# EAGLE schematic Controller v1.1 (EAGLE 9.6.2)
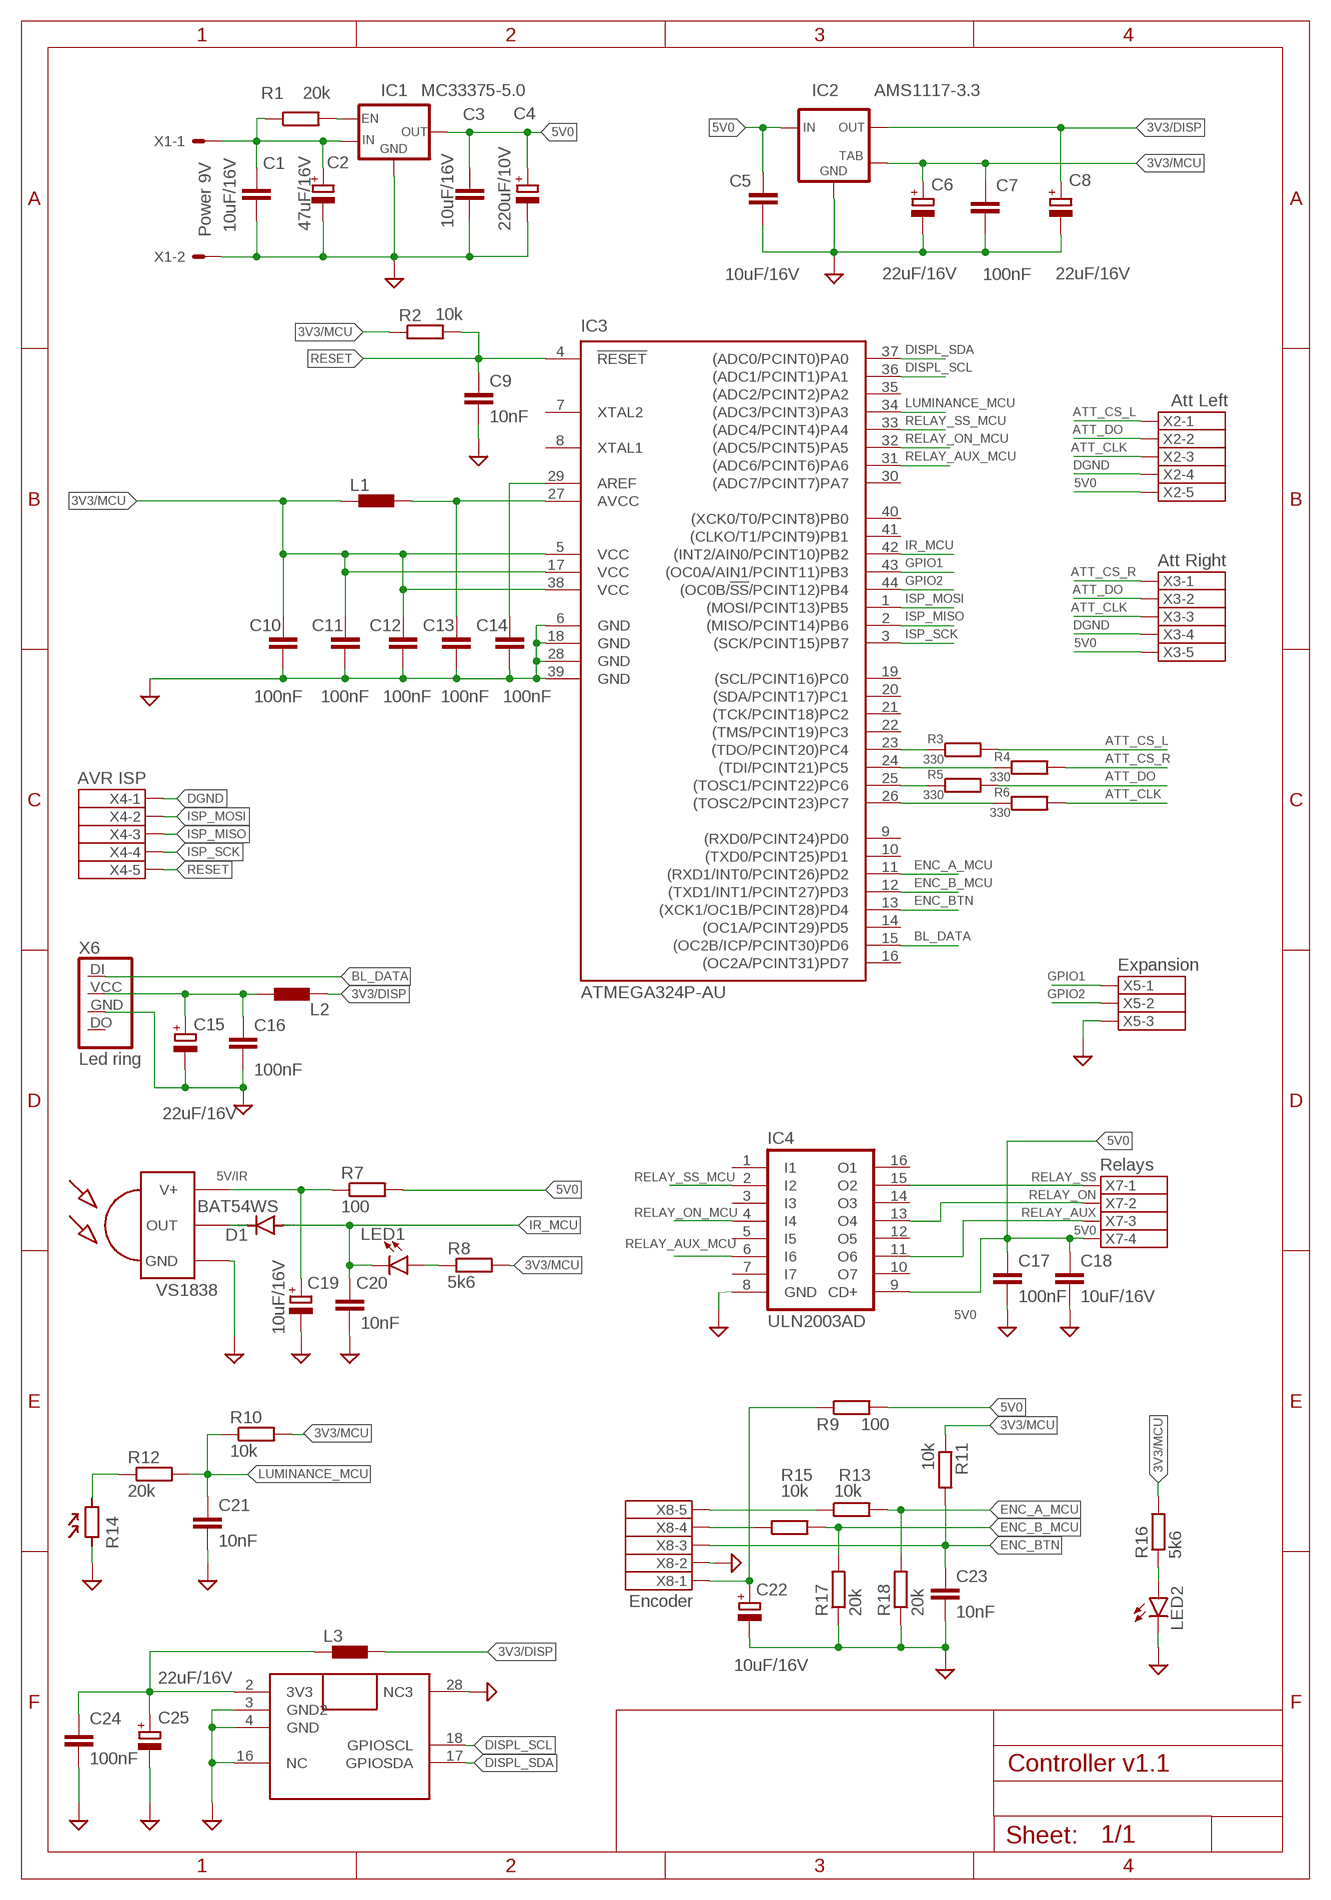
[diagram p0: schematic, sheet 1]

## Parts
C1  10uF/16V  C-EUC0805  [C0805]
C2  47uF/16V  CPOL-EUSMCC  [SMC_C]
C3  10uF/16V  C-EUC0805  [C0805]
C4  220uF/10V  CPOL-EUSMCC  [SMC_C]
C5  10uF/16V  C-EUC0805  [C0805]
C6  22uF/16V  CPOL-EUSMCB  [SMC_B]
C7  100nF  C-EUC0603  [C0603]
C8  22uF/16V  CPOL-EUSMCB  [SMC_B]
C9  10nF  C-EUC0603  [C0603]
C10  100nF  C-EUC0603  [C0603]
C11  100nF  C-EUC0603  [C0603]
C12  100nF  C-EUC0603  [C0603]
C13  100nF  C-EUC0603  [C0603]
C14  100nF  C-EUC0603  [C0603]
C15  22uF/16V  CPOL-EUSMCB  [SMC_B]
C16  100nF  C-EUC0603  [C0603]
C17  100nF  C-EUC0603  [C0603]
C18  10uF/16V  C-EUC0805  [C0805]
C19  10uF/16V  CPOL-EUSMCA  [SMC_A]
C20  10nF  C-EUC0603  [C0603]
C21  10nF  C-EUC0603  [C0603]
C22  10uF/16V  CPOL-EUSMCA  [SMC_A]
C23  10nF  C-EUC0603  [C0603]
C24  100nF  C-EUC0603  [C0603]
C25  22uF/16V  CPOL-EUSMCB  [SMC_B]
D1  BAT54WS  DIODE-SOD323-W  [SOD323-W]
DM1  FEATHERWING_ZD50DISPLAY_ZD50  [FEATHERWING_ZD50]
IC1  MC33375-5.0  MC33375  [SOT223]
IC2  AMS1117-3.3  LM1117  [SOT223]
IC3  ATMEGA324P-AU  MEGA164P/324P/644P-AU  [TQFP44]
IC4  ULN2003AD  [SO16]
IR1  VS1838  TSOP1838  [TSOP18XX]
L1  BLM21PG221SN1D  BLM21PG2210805  [0805]
L2  BLM21PG221SN1D  BLM21PG2210805  [0805]
L3  10uH  BLM21PG2210805  [0805]
LED1  LEDSML0805  [SML0805]
LED2  LEDSML0805  [SML0805]
R1  20k  R-EU_R0603  [R0603]
R2  10k  R-EU_R0805  [R0805]
R3  330  R-EU_R0805  [R0805]
R4  330  R-EU_R0805  [R0805]
R5  330  R-EU_R0805  [R0805]
R6  330  R-EU_R0805  [R0805]
R7  100  R-EU_R0805  [R0805]
R8  5k6  R-EU_R0805  [R0805]
R9  100  R-EU_R1206  [R1206]
R10  10k  R-EU_R0805  [R0805]
R11  10k  R-EU_R1206  [R1206]
R12  20k  R-EU_R0805  [R0805]
R13  10k  R-EU_R0805  [R0805]
R14  GL5537  [GL55]
R15  10k  R-EU_R0805  [R0805]
R16  5k6  R-EU_R0805  [R0805]
R17  20k  R-EU_R0805  [R0805]
R18  20k  R-EU_R0805  [R0805]
X1  Power 9V  22-23-2021  [22-23-2021]
X2  Att Left  JST-XH-05-PIN-LONG-PAD  [JST-XH-05-PACKAGE-LONG-PAD]
X3  Att Right  JST-XH-05-PIN-LONG-PAD  [JST-XH-05-PACKAGE-LONG-PAD]
X4  AVR ISP  JST-XH-05-PIN-LONG-PAD  [JST-XH-05-PACKAGE-LONG-PAD]
X5  Expansion  JST-XH-03-PIN-LONG-PAD  [JST-XH-03-PACKAGE-LONG-PAD]
X6  Led ring  LED_RING_CONN  [LED_RING_CONN]
X7  Relays  JST-XH-04-PIN-LONG-PAD  [JST-XH-04-PACKAGE-LONG-PAD]
X8  Encoder  JST-XH-05-PIN-ROUND-PAD  [JST-XH-05-PACKAGE-ROUND-PAD]

## Nets
3V3/AVCC: C13.1 IC3.27(AVCC) L1.2
3V3/DISP: C8.+ IC2.2(OUT) L2.2 L3.2
3V3/MCU: C6.+ C7.1 C10.1 C11.1 C12.1 IC2.4(TAB) IC3.5(VCC) IC3.17(VCC) IC3.38(VCC) L1.1 R2.1 R8.2 R10.2 R11.1 R16.2
5V0: C3.1 C4.+ C5.1 C17.1 C18.1 IC1.3(OUT) IC2.3(IN) IC4.9(CD+) R7.2 R9.2 X2.5 X3.5 X7.4
5V/EN: IC1.2(EN) R1.2
5V/ENC: C22.+ R9.1 X8.1
5V/IR: C19.+ IR1.VCC(V+) R7.1
+9V/IN: C1.1 C2.+ IC1.1(IN) R1.1 X1.1
AREF: C14.1 IC3.29(AREF)
ATT_CLK: R6.2 X2.3 X3.3
ATT_CS_L: R3.2 X2.1
ATT_CS_R: R4.2 X3.1
ATT_DO: R5.2 X2.2 X3.2
BL_3V3: C15.+ C16.1 L2.1 X6.VCC
BL_DATA: IC3.15((OC2B/ICP/PCINT30)PD6) X6.DI
DGND: C1.2 C2.- C3.2 C4.- C5.2 C6.- C7.2 C8.- C9.2 C10.2 C11.2 C12.2 C13.2 C14.2 C15.- C16.2 C17.2 C18.2 C19.- C20.2 C21.2 C22.- C23.2 C24.2 C25.- DM1.3(GND2) DM1.4(GND) DM1.16(NC) DM1.28(NC3) IC1.4(GND) IC2.1(GND) IC3.6(GND) IC3.18(GND) IC3.28(GND) IC3.39(GND) IC4.8(GND) IR1.GND LED2.C R14.P$1 R17.1 R18.1 X1.2 X2.4 X3.4 X4.1 X5.3 X6.GND X8.2
DISPL_3V3: C24.1 C25.+ DM1.2(3V3) L3.1
DISPL_SCL: DM1.18(GPIOSCL) IC3.36((ADC1/PCINT1)PA1)
DISPL_SDA: DM1.17(GPIOSDA) IC3.37((ADC0/PCINT0)PA0)
ENC_A: R13.1 X8.5
ENC_A_MCU: IC3.11((RXD1/INT0/PCINT26)PD2) R13.2 R18.2
ENC_B: R15.1 X8.4
ENC_B_MCU: IC3.12((TXD1/INT1/PCINT27)PD3) R15.2 R17.2
ENC_BTN: C23.1 IC3.13((XCK1/OC1B/PCINT28)PD4) R11.2 X8.3
GPIO1: IC3.43((OC0A/AIN1/PCINT11)PB3) X5.1
GPIO2: IC3.44((OC0B/!SS!/PCINT12)PB4) X5.2
IR_MCU: C20.1 D1.A IC3.42((INT2/AIN0/PCINT10)PB2) LED1.C
IR_OUT: D1.C IR1.OUT
ISP_MISO: IC3.2((MISO/PCINT14)PB6) X4.3
ISP_MOSI: IC3.1((MOSI/PCINT13)PB5) X4.2
ISP_SCK: IC3.3((SCK/PCINT15)PB7) X4.4
LIGHT_SENSOR: R12.1 R14.P$2
LUMINANCE_MCU: C21.1 IC3.34((ADC3/PCINT3)PA3) R10.1 R12.2
N$1: LED2.A R16.1
N$5: LED1.A R8.1
N$7: IC3.23((TDO/PCINT20)PC4) R3.1
N$8: IC3.24((TDI/PCINT21)PC5) R4.1
N$9: IC3.25((TOSC1/PCINT22)PC6) R5.1
N$10: IC3.26((TOSC2/PCINT23)PC7) R6.1
RELAY_AUX: IC4.11(O6) X7.3
RELAY_AUX_MCU: IC3.31((ADC6/PCINT6)PA6) IC4.6(I6)
RELAY_ON: IC4.13(O4) X7.2
RELAY_ON_MCU: IC3.32((ADC5/PCINT5)PA5) IC4.4(I4)
RELAY_SS: IC4.15(O2) X7.1
RELAY_SS_MCU: IC3.33((ADC4/PCINT4)PA4) IC4.2(I2)
RESET: C9.1 IC3.4(!RESET) R2.2 X4.5
Unconnected: IC3.7(XTAL2) IC3.8(XTAL1) IC3.9((RXD0/PCINT24)PD0) IC3.10((TXD0/PCINT25)PD1) IC3.14((OC1A/PCINT29)PD5) IC3.16((OC2A/PCINT31)PD7) IC3.19((SCL/PCINT16)PC0) IC3.20((SDA/PCINT17)PC1) IC3.21((TCK/PCINT18)PC2) IC3.22((TMS/PCINT19)PC3) IC3.30((ADC7/PCINT7)PA7) IC3.35((ADC2/PCINT2)PA2) IC3.40((XCK0/T0/PCINT8)PB0) IC3.41((CLKO/T1/PCINT9)PB1) IC4.1(I1) IC4.3(I3) IC4.5(I5) IC4.7(I7) IC4.10(O7) IC4.12(O5) IC4.14(O3) IC4.16(O1) X6.DO

## Library data of the parts
C1 = rcl:C-EU: CAPACITOR, European symbol; BUY_URL: https://imrad.com.ua/ru/cl21b106koqnnne; PARTNAME: CL21B106KOQNNNE; SPICEPREFIX: C
C2 = rcl:CPOL-EU: POLARIZED CAPACITOR, European symbol; PARTNAME: 293D476X9016C2TE3; SPICEPREFIX: C
C3 C5 C18 C23 = rcl:C-EU: CAPACITOR, European symbol; PARTNAME: CL21B106KOQNNNE; SPICEPREFIX: C
C4 = rcl:CPOL-EU: POLARIZED CAPACITOR, European symbol; SPICEPREFIX: C
C6 C8 C15 C25 = rcl:CPOL-EU: POLARIZED CAPACITOR, European symbol; PARTNAME: 293D226X9016B2TE3; SPICEPREFIX: C
C7 C9-C14 C16 C17 C20 C21 C24 = rcl:C-EU: CAPACITOR, European symbol; SPICEPREFIX: C
C19 C22 = rcl:CPOL-EU: POLARIZED CAPACITOR, European symbol; PARTNAME: TAJA106K010RNJ; SPICEPREFIX: C
D1 = diode:DIODE-: DIODE; PARTNAME: BAT54WS
DM1 = Feather DotMatrix8x16:FEATHERWING_ZD50
IC1 = Voltage Regulators:MC33375
IC2 = v-reg-2:LM1117
IC3 = AVR Devices:MEGA164P/324P/644P-AU
IC4 = uln-udn:ULN2003A: DRIVER ARRAY
IR1 = tsop-1:TSOP1838: IR Receiver and Demodulator
L1-L3 = components:BLM21PG221: BLM21PG 221 EMI Suppression Filter SMD0805 BLM21 220 Ohm; PARTNAME: BLM21PG221SN1D
LED1 LED2 = led:LED: LED OSRAM: - CHIPLED LG R971, LG N971, LY N971, LG Q971, LY Q971, LO R971, LY R971 LH N974, LH R974 LS Q976, LO Q976, LY Q976 LO Q996 - Hyper CHIPLED LW Q18S LB Q993, LB Q99A, LB R99A - SideLED LS A670, LO A670, LY A670, LG A670, LP A670 LB A673, LV A673, LT A673, LW A673 LH A674 LY A675 LS A676, LA A676, LO A676, LY A676, LW A676 LS A679, LY A679, LG A679 - Hyper Micro SIDELED® LS Y876, LA Y876, LO Y876, LY Y876 LT Y87S - SmartLED LW L88C, LW L88S LB L89C, LB L89S, LG L890 LS L89K, LO L89K, LY L89K LS L896, LA L896, LO L896, LY L896 - TOPLED LS T670, LO T670, LY T670, LG T670, LP T670 LSG T670, LSP T670, LSY T670, LOP T670, LYG T670 LG T671, LOG T671, LSG T671 LB T673, LV T673, LT T673, LW T673 LH T674 LS T676, LA T676, LO T676, LY T676, LB T676, LH T676, LSB T676, LW T676 LB T67C, LV T67C, LT T67C, LS T67K, LO T67K, LY T67K, LW E67C LS E67B, LA E67B, LO E67B, LY E67B, LB E67C, LV E67C, LT E67C LW T67C LS T679, LY T679, LG T679 LS T770, LO T770, LY T770, LG T770, LP T770 LB T773, LV T773, LT T773, LW T773 LH T774 LS E675, LA E675, LY E675, LS T675 LS T776, LA T776, LO T776, LY T776, LB T776 LHGB T686 LT T68C, LB T68C - Hyper Mini TOPLED® LB M676 - Mini TOPLED Santana® LG M470 LS M47K, LO M47K, LY M47K Source: http://www.osram.convergy.de LUXEON: - LUMILED® LXK2-PW12-R00, LXK2-PW12-S00, LXK2-PW14-U00, LXK2-PW14-V00 LXK2-PM12-R00, LXK2-PM12-S00, LXK2-PM14-U00 LXK2-PE12-Q00, LXK2-PE12-R00, LXK2-PE12-S00, LXK2-PE14-T00, LXK2-PE14-U00 LXK2-PB12-K00, LXK2-PB12-L00, LXK2-PB12-M00, LXK2-PB14-N00, LXK2-PB14-P00, LXK2-PB14-Q00 LXK2-PR12-L00, LXK2-PR12-M00, LXK2-PR14-Q00, LXK2-PR14-R00 LXK2-PD12-Q00, LXK2-PD12-R00, LXK2-PD12-S00 LXK2-PH12-R00, LXK2-PH12-S00 LXK2-PL12-P00, LXK2-PL12-Q00, LXK2-PL12-R00 Source: www.luxeon.com KINGBRIGHT: KA-3528ASYC Source: www.kingbright.com
R1-R13 R15-R18 = rcl:R-EU_: RESISTOR, European symbol; SPICEPREFIX: R
R14 = misc:GL5537: GL5537 Photoresistor
X1 = con-molex:22-23-2021: .100" (2.54mm) Center Header - 2 Pin; MF: MOLEX; MPN: 22-23-2021; OC_FARNELL: 1462926; OC_NEWARK: 25C3832
X2-X4 X8 = JST XH Connectors v1-0:JST-XH-05-PIN: JST XH Connector 2 Pin Wire to board connector. Pitch: 2,54 mm, (0.100") Number of pins: 5 Created by Rembrandt Electronics www.rembrandtelectronics.com
X5 = JST XH Connectors v1-0:JST-XH-03-PIN: JST XH Connector 2 Pin Wire to board connector. Pitch: 2,54 mm, (0.100") Number of pins: 3 Created by Rembrandt Electronics www.rembrandtelectronics.com
X6 = Connectors:LED_RING_CONN
X7 = JST XH Connectors v1-0:JST-XH-04-PIN: JST XH Connector 2 Pin Wire to board connector. Pitch: 2,54 mm, (0.100") Number of pins: 4 Created by Rembrandt Electronics www.rembrandtelectronics.com